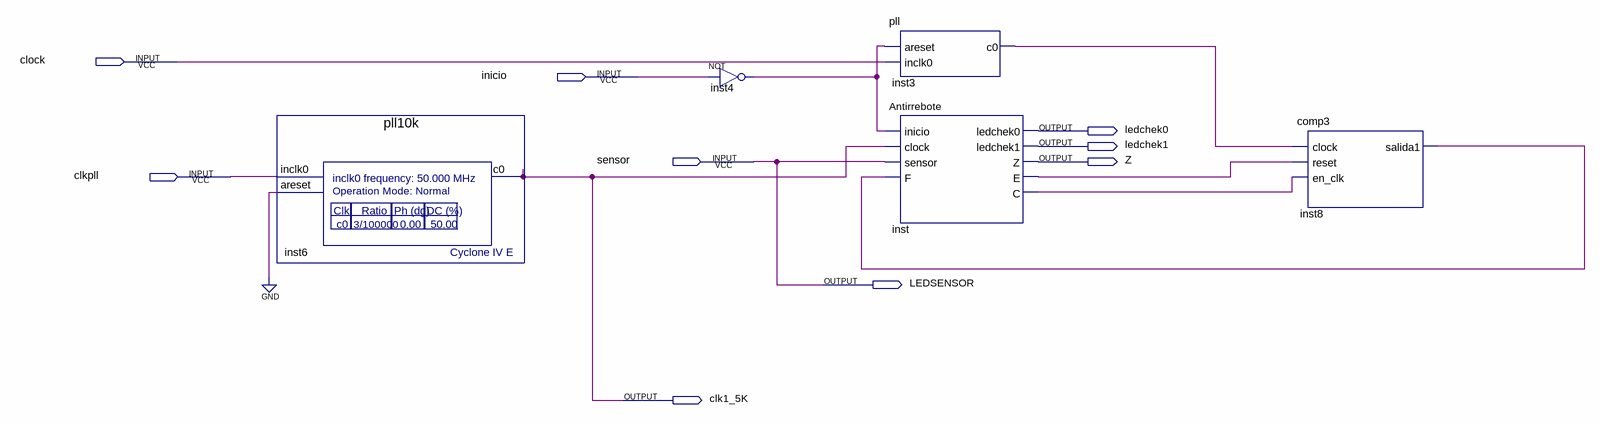
[diagram p0: schematic sheet]
// Quartus schematic Antirreboteesquema.bdf as structural Verilog: 5 symbols, 9 pins
module Antirreboteesquema (
  input  clock,
  input  inicio,
  input  sensor,
  input  clkpll,
  output ledchek0,
  output ledchek1,
  output Z,
  output LEDSENSOR,
  output clk1_5K
);

  wire inst3_c0, inst4_out, inst8_salida1, inst_c, inst_e;

  pll10k inst6 (.inclk0(clkpll), .areset(1'b0), .c0(clk1_5K));
  not inst4 (inst4_out, inicio);
  pll inst3 (.areset(inst4_out), .inclk0(clock), .c0(inst3_c0));
  Antirrebote inst (
    .inicio(inst4_out), .clock(clk1_5K), .sensor(sensor), .F(inst8_salida1), .ledchek0(ledchek0),
    .ledchek1(ledchek1), .Z(Z), .E(inst_e), .C(inst_c));
  comp3 inst8 (.clock(inst3_c0), .reset(inst_e), .en_clk(inst_c), .salida1(inst8_salida1));

  assign LEDSENSOR = sensor;
endmodule
